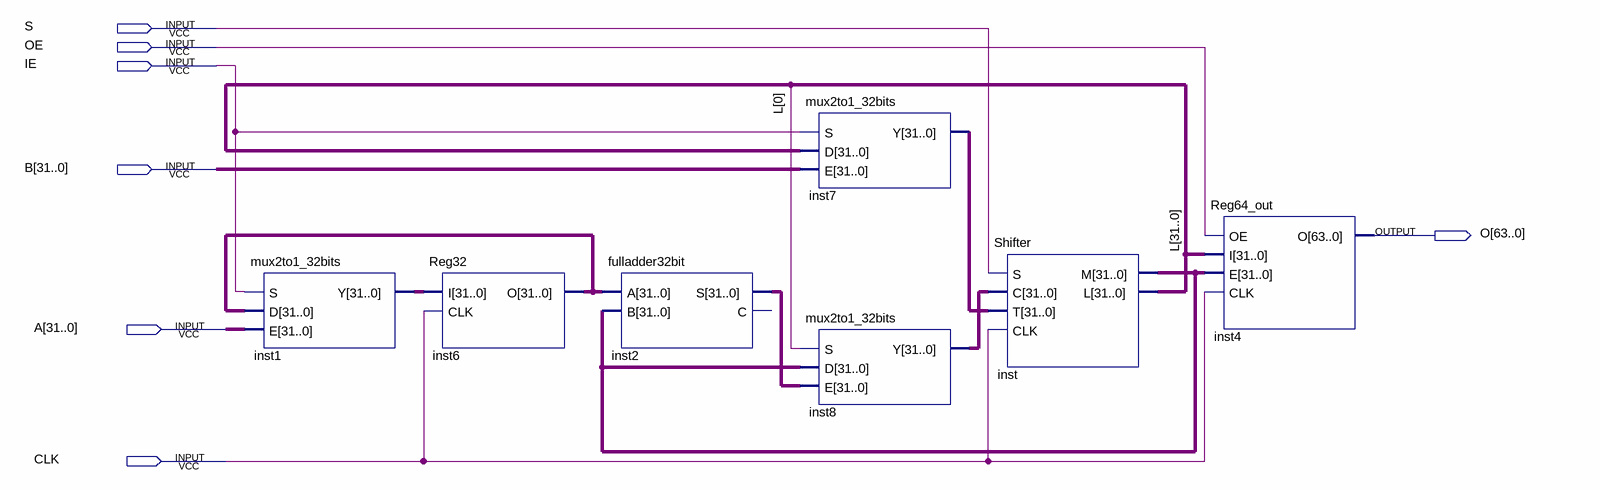
[diagram p0: schematic sheet]
// Quartus schematic DATAPATH.bdf as structural Verilog: 7 symbols, 7 pins
module DATAPATH (
  input  S,
  input  OE,
  input  IE,
  input  [31:0] B,
  input  [31:0] A,
  input  CLK,
  output [63:0] O
);

  wire [31:0] inst1_y, inst2_s, inst6_o, inst7_y, inst8_y, inst_m, L;

  mux2to1_32bits inst1 (.S(IE), .D(inst6_o), .E(A), .Y(inst1_y));
  Reg32 inst6 (.I(inst1_y), .CLK(CLK), .O(inst6_o));
  fulladder32bit inst2 (.A(inst6_o), .B(inst_m), .S(inst2_s));  // open: C
  mux2to1_32bits inst7 (.S(IE), .D(L), .E(B), .Y(inst7_y));
  mux2to1_32bits inst8 (.S(L[0]), .D(inst_m), .E(inst2_s), .Y(inst8_y));
  Shifter inst (.S(S), .C(inst8_y), .T(inst7_y), .CLK(CLK), .M(inst_m), .L(L));
  Reg64_out inst4 (.OE(OE), .I(L), .E(inst_m), .CLK(CLK), .O(O));
endmodule
